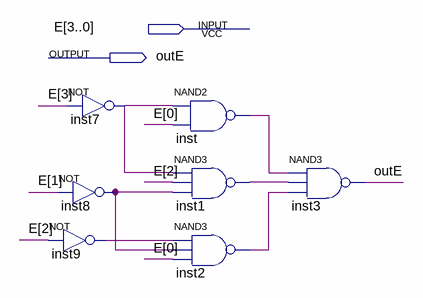
[diagram p0: schematic sheet]
// Quartus schematic BCDe.bdf as structural Verilog: 7 symbols, 2 pins
module BCDe (
  input  [3:0] E,
  output outE
);

  wire inst1_out, inst2_out, inst7_out, inst8_out, inst9_out, inst_out;

  not inst7 (inst7_out, E[3]);
  not inst8 (inst8_out, E[1]);
  not inst9 (inst9_out, E[2]);
  nand inst (inst_out, inst7_out, E[0]);
  nand inst1 (inst1_out, inst7_out, E[2], inst8_out);
  nand inst2 (inst2_out, inst9_out, inst8_out, E[0]);
  nand inst3 (outE, inst_out, inst1_out, inst2_out);
endmodule
